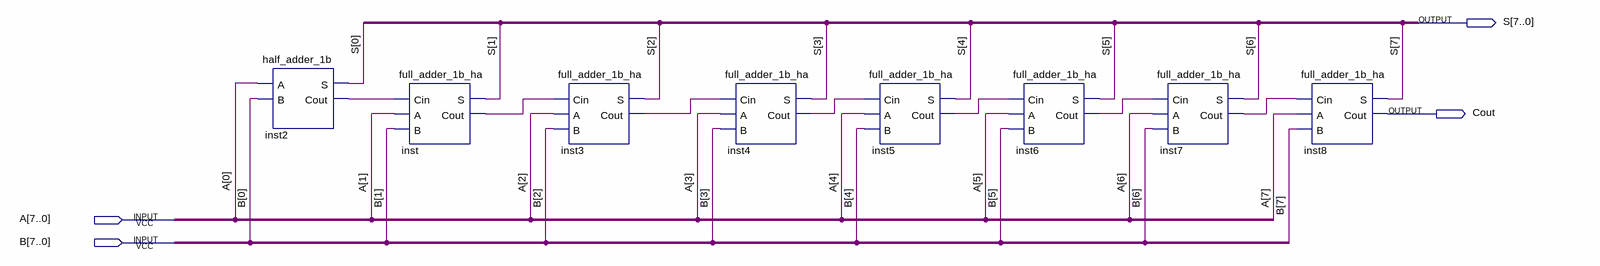
[diagram p0: schematic sheet]
// Quartus schematic ripple_carry_adder_8b.bdf as structural Verilog: 8 symbols, 4 pins
module ripple_carry_adder_8b (
  input  [7:0] A,
  input  [7:0] B,
  output [7:0] S,
  output Cout
);

  wire inst2_cout, inst3_cout, inst4_cout, inst5_cout, inst6_cout, inst7_cout, inst_cout;

  half_adder_1b inst2 (.A(A[0]), .B(B[0]), .S(S[0]), .Cout(inst2_cout));
  full_adder_1b_ha inst (.Cin(inst2_cout), .A(A[1]), .B(B[1]), .S(S[1]), .Cout(inst_cout));
  full_adder_1b_ha inst3 (.Cin(inst_cout), .A(A[2]), .B(B[2]), .S(S[2]), .Cout(inst3_cout));
  full_adder_1b_ha inst4 (.Cin(inst3_cout), .A(A[3]), .B(B[3]), .S(S[3]), .Cout(inst4_cout));
  full_adder_1b_ha inst5 (.Cin(inst4_cout), .A(A[4]), .B(B[4]), .S(S[4]), .Cout(inst5_cout));
  full_adder_1b_ha inst6 (.Cin(inst5_cout), .A(A[5]), .B(B[5]), .S(S[5]), .Cout(inst6_cout));
  full_adder_1b_ha inst7 (.Cin(inst6_cout), .A(A[6]), .B(B[6]), .S(S[6]), .Cout(inst7_cout));
  full_adder_1b_ha inst8 (.Cin(inst7_cout), .A(A[7]), .B(B[7]), .S(S[7]), .Cout(Cout));
endmodule
